# EAGLE design schem (EAGLE 5.10)
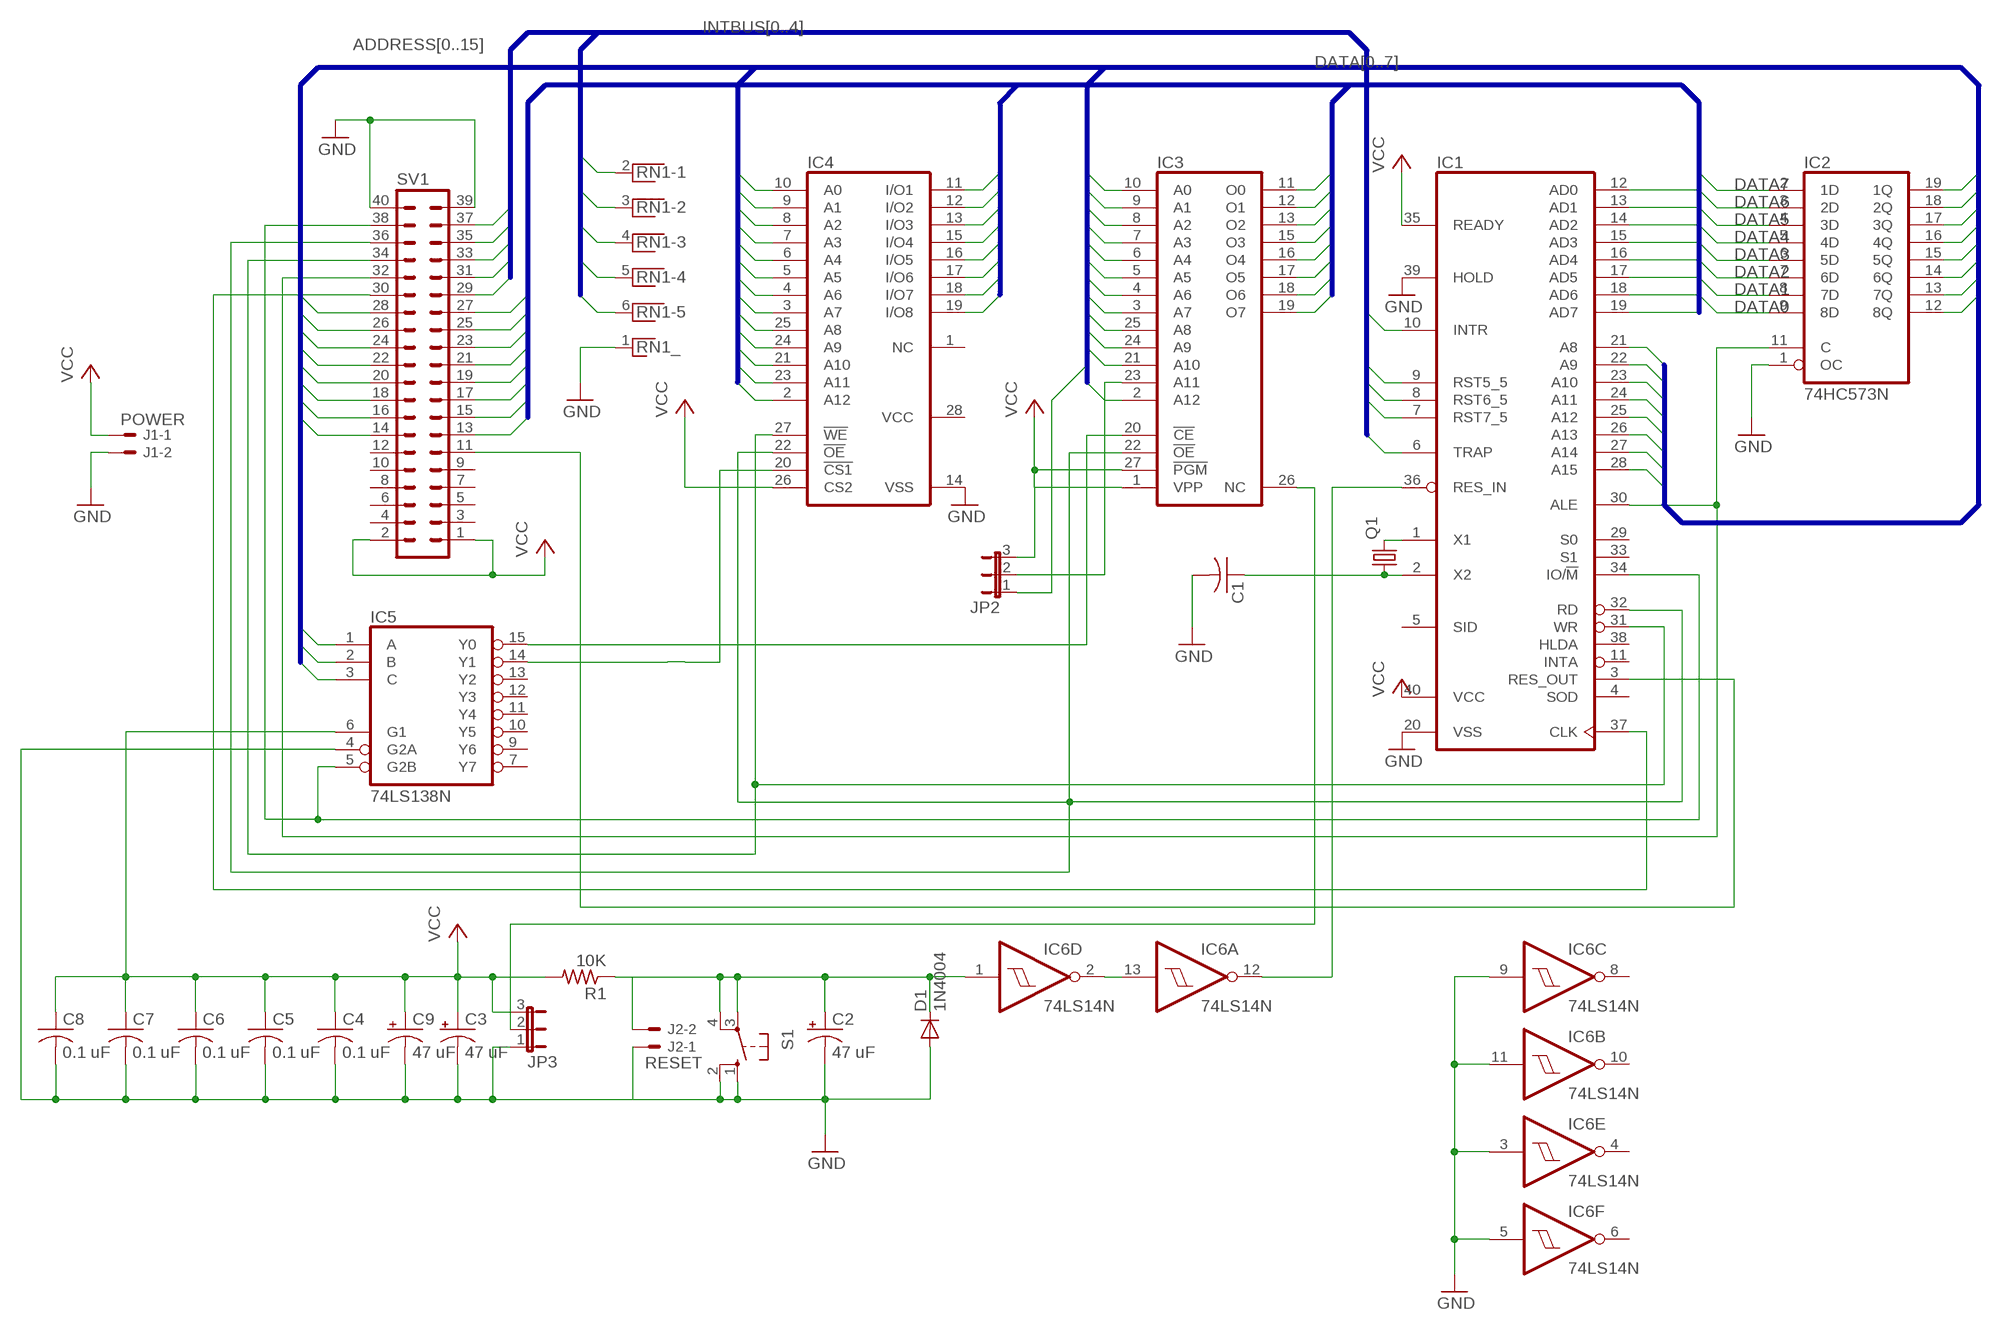
[diagram p0: schematic, sheet 1]

## Parts
C1  C-US050-024X044  [C050-024X044]
C2  47 uF  CPOL-USE2.5-6  [E2,5-6]
C3  47 uF  CPOL-USE15-6AXIAL  [E15-6]
C4  0.1 uF  C-US075-032X103  [C075-032X103]
C5  0.1 uF  C-US075-032X103  [C075-032X103]
C6  0.1 uF  C-US075-032X103  [C075-032X103]
C7  0.1 uF  C-US075-032X103  [C075-032X103]
C8  0.1 uF  C-US075-032X103  [C075-032X103]
C9  47 uF  CPOL-USE15-6AXIAL  [E15-6]
D1  1N4004  [DO41-10]
IC1  8085  [DIL40]
IC2  74HC573N  [DIL20]
IC3  2764  [DIL28]
IC4  6264A  [DIL28-6]
IC5  74LS138N  [DIL16]
IC6  74LS14N  [DIL14]
J1  POWER  22-05-7028-02  [7395-02]
J2  RESET  22-05-7028-02  [7395-02]
JP2  JP2E  [JP2]
JP3  JP2E  [JP2]
Q1  CRYSTALHC18U-H  [HC18U-H]
R1  10K  R-US_0207/10  [0207/10]
RN1  RNX5  [RN-6]
S1  10-XX  [B3F-10XX]
SV1  MA20-2W  [MA20-2W]

## Nets
ADDRESS0: IC2.12(8Q) IC3.10(A0) IC4.10(A0)
ADDRESS1: IC2.13(7Q) IC3.9(A1) IC4.9(A1)
ADDRESS2: IC2.14(6Q) IC3.8(A2) IC4.8(A2)
ADDRESS3: IC2.15(5Q) IC3.7(A3) IC4.7(A3)
ADDRESS4: IC2.16(4Q) IC3.6(A4) IC4.6(A4)
ADDRESS5: IC2.17(3Q) IC3.5(A5) IC4.5(A5)
ADDRESS6: IC2.18(2Q) IC3.4(A6) IC4.4(A6)
ADDRESS7: IC2.19(1Q) IC3.3(A7) IC4.3(A7)
ADDRESS8: IC1.21(A8) IC3.25(A8) IC4.25(A8) SV1.14
ADDRESS9: IC1.22(A9) IC3.24(A9) IC4.24(A9) SV1.16
ADDRESS10: IC1.23(A10) IC3.21(A10) IC4.21(A10) SV1.18
ADDRESS11: IC1.24(A11) IC4.23(A11) JP2.1 SV1.20
ADDRESS12: IC1.25(A12) IC3.2(A12) IC4.2(A12) SV1.22
ADDRESS13: IC1.26(A13) IC5.1(A) SV1.24
ADDRESS14: IC1.27(A14) IC5.2(B) SV1.26
ADDRESS15: IC1.28(A15) IC5.3(C) SV1.28
ALE: IC1.30(ALE) IC2.11(C) SV1.32
CLKOUT: IC1.37(CLK) SV1.30
DATA0: IC1.12(AD0) IC2.9(8D) IC3.11(O0) IC4.11(I/O1) SV1.27
DATA1: IC1.13(AD1) IC2.8(7D) IC3.12(O1) IC4.12(I/O2) SV1.25
DATA2: IC1.14(AD2) IC2.7(6D) IC3.13(O2) IC4.13(I/O3) SV1.23
DATA3: IC1.15(AD3) IC2.6(5D) IC3.15(O3) IC4.15(I/O4) SV1.21
DATA4: IC1.16(AD4) IC2.5(4D) IC3.16(O4) IC4.16(I/O5) SV1.19
DATA5: IC1.17(AD5) IC2.4(3D) IC3.17(O5) IC4.17(I/O6) SV1.17
DATA6: IC1.18(AD6) IC2.3(2D) IC3.18(O6) IC4.18(I/O7) SV1.15
DATA7: IC1.19(AD7) IC2.2(1D) IC3.19(O7) IC4.19(I/O8) SV1.13
GND: C1.2 C2.- C3.- C4.2 C5.2 C6.2 C7.2 C8.2 C9.- D1.A IC1.20(VSS) IC1.39(HOLD) IC2.1(OC) IC4.14(VSS) IC5.4(G2A) IC6.3(E:I) IC6.5(F:I) IC6.9(C:I) IC6.11(B:I) J1.2 J2.1 JP3.1 RN1.1 S1.1(S) S1.2(S1) SV1.39 SV1.40
INTBUS0: IC1.6(TRAP) RN1.2 SV1.37
INTBUS1: IC1.7(RST7_5) RN1.3 SV1.35
INTBUS2: IC1.8(RST6_5) RN1.4 SV1.33
INTBUS3: IC1.9(RST5_5) RN1.5 SV1.31
INTBUS4: IC1.10(INTR) RN1.6 SV1.29
IO/M: IC1.34(IO/!M) IC5.5(G2B) SV1.38
N$1: IC6.2(D:O) IC6.13(A:I)
N$2: IC3.26(NC) JP3.2
N$3: IC4.20(!CS1) IC5.14(Y1)
N$4: IC1.36(RES_IN) IC6.12(A:O)
N$5: IC3.20(!CE) IC5.15(Y0)
N$6: IC1.3(RES_OUT) SV1.11
N$7: IC3.23(A11) JP2.2
N$8: IC1.1(X1) Q1.2
N$10: C1.1 IC1.2(X2) Q1.1
RD: IC1.32(RD) IC3.22(!OE) IC4.22(!OE) SV1.36
RESET_IN: C2.+ D1.C IC6.1(D:I) J2.2 R1.1 S1.3(P) S1.4(P1)
VCC: C3.+ C4.1 C5.1 C6.1 C7.1 C8.1 C9.+ IC1.35(READY) IC1.40(VCC) IC3.1(VPP) IC3.27(!PGM) IC4.26(CS2) IC5.6(G1) J1.1 JP2.3 JP3.3 R1.2 SV1.1 SV1.2
WR: IC1.31(WR) IC4.27(!WE) SV1.34
Unconnected: IC1.4(SOD) IC1.5(SID) IC1.11(INTA) IC1.29(S0) IC1.33(S1) IC1.38(HLDA) IC4.1(NC) IC5.7(Y7) IC5.9(Y6) IC5.10(Y5) IC5.11(Y4) IC5.12(Y3) IC5.13(Y2) IC6.4(E:O) IC6.6(F:O) IC6.8(C:O) IC6.10(B:O) SV1.3 SV1.4 SV1.5 SV1.6 SV1.7 SV1.8 SV1.9 SV1.10 SV1.12

## Buses
DATA[0..7]
ADDRESS[0..15]
INTBUS[0..4]

## Power pins joined to a net without a drawn wire
GND: IC2.10(GND) IC3.14(GND) IC5.8(GND) IC6.7(P:GND)
VCC: IC2.20(VCC) IC3.28(VCC) IC4.28(VCC) IC5.16(VCC) IC6.14(P:VCC)

## Library data of the parts
C1 C4-C8 = resistor:C-US: CAPACITOR, American symbol
C2 C3 C9 = resistor:CPOL-US: POLARIZED CAPACITOR, American symbol
D1 = diode:1N4004: DIODE general purpose rectifier, 1 A
IC1 = micro-intel:8085: MICROCOMPUTER/PERIPHERAL DEVICE
IC2 = 74xx-us:74*573: 8-bit D latch BUS DRIVER
IC3 = memory:2764: MEMORY
IC4 = memory-hitachi:6264A: MEMORY
IC5 = 74xx-us:74*138: 3-line to 8-line DECODER/DEMULTIPLEXER
IC6 = 74xx-us:74*14: Hex schmitt trigger INVERTER
J1 J2 = con-molex:22-?-02: CONNECTOR wire to board 2.54 mm (.1 inch) pitch header
JP2 JP3 = jumper:JP2E: JUMPER
Q1 = crystal:CRYSTAL: CRYSTAL
R1 = resistor:R-US_: RESISTOR, American symbol
RN1 = resistor-net:RNX5: RESISTOR NETWORK
S1 = switch-omron:10-XX: OMRON SWITCH
SV1 = con-lstb:MA20-2W: PIN HEADER

## Board
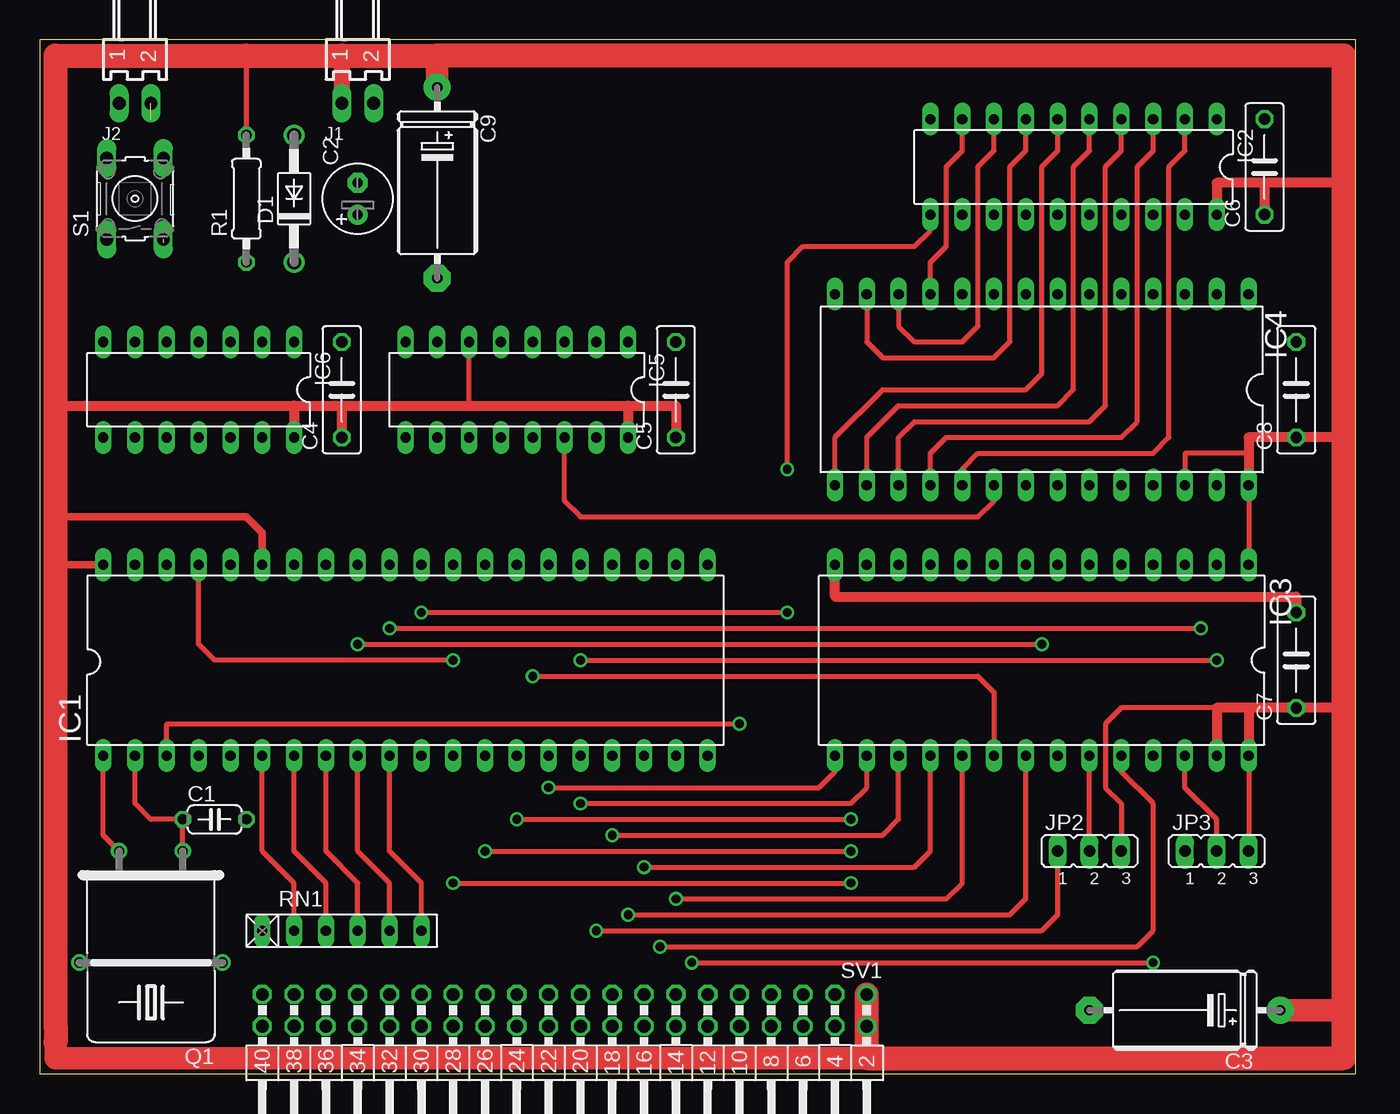
[diagram p1: board, top side]
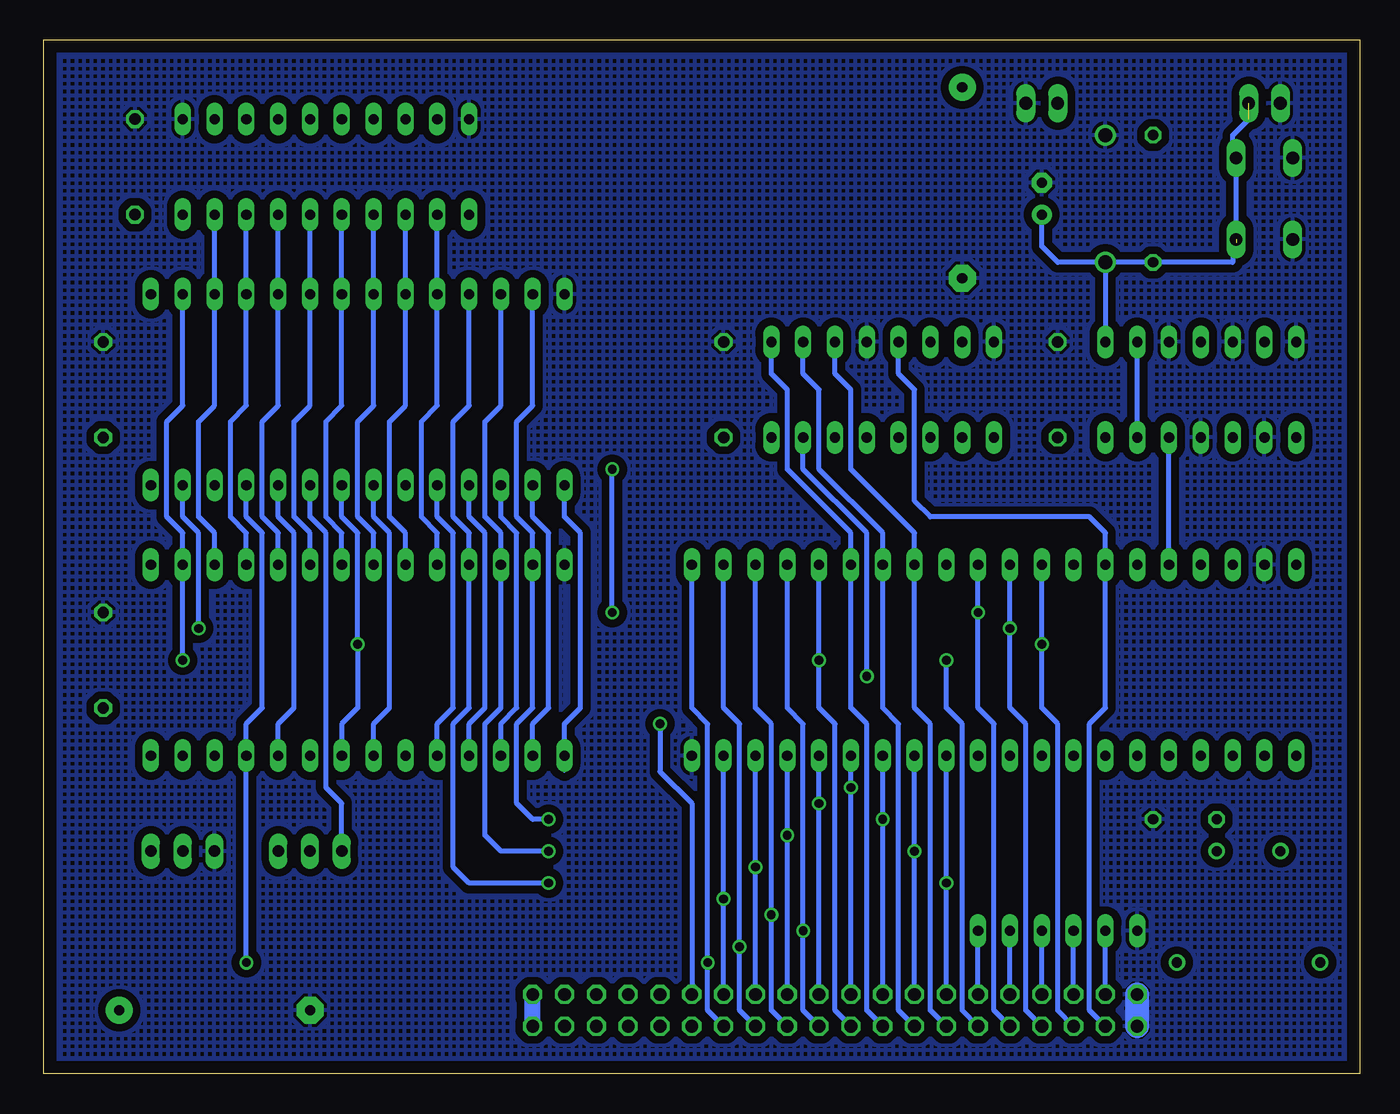
[diagram p2: board, bottom side, seen from below]

Size 105.08 x 82.54 mm. Coordinates in mm from the lower left corner, seen from the top.
Outline: 0,0 105.08,0 105.08,82.54 0,82.54 0,0
Copper layers (1*16): Top 0.035mm / dielectric 1.5mm / Bottom 0.035mm
Design rules "default *": minimum track width 10mil, minimum drill 15mil, track to track 8mil, track to pad 8mil, pad to pad 8mil, via to via 8mil, smd to smd 8mil, copper to edge 40mil, drill to drill 8mil, minimum pad ring 10mil, minimum via ring 8mil, stop-mask expansion 4mil, vias tented up to drill 0mil, thermal gap 10mil

### Footprints (pad centres in the part's own frame; a part is rotated, then mirrored left to right if it is on the bottom)
C050-024X044 = drill 0.813 octagon: 1 -2.54,0; 2 2.54,0
E2,5-6 = drill 0.813 pad 1.6 round: + -1.27,0 | drill 0.813 pad 1.6 octagon: - 1.27,0
E15-6 = drill 0.813 pad 2.159 round: + -7.62,0 | drill 0.813 pad 2.159 octagon: - 7.62,0
C075-032X103 = drill 0.914 octagon: 1 -3.81,0; 2 3.81,0
DO41-10 = drill 1.118 round: A 5.08,0; C -5.08,0
DIL40 = drill 0.813 long: 1 -24.13,-7.62; 2 -21.59,-7.62; 3 -19.05,-7.62; 4 -16.51,-7.62; 5 -13.97,-7.62; 6 -11.43,-7.62; 7 -8.89,-7.62; 8 -6.35,-7.62; 9 -3.81,-7.62; 10 -1.27,-7.62; 11 1.27,-7.62; 12 3.81,-7.62; 13 6.35,-7.62; 14 8.89,-7.62; 15 11.43,-7.62; 16 13.97,-7.62; 17 16.51,-7.62; 18 19.05,-7.62; 19 21.59,-7.62; 20 24.13,-7.62; 21 24.13,7.62; 22 21.59,7.62; 23 19.05,7.62; 24 16.51,7.62; 25 13.97,7.62; 26 11.43,7.62; 27 8.89,7.62; 28 6.35,7.62; 29 3.81,7.62; 30 1.27,7.62; 31 -1.27,7.62; 32 -3.81,7.62; 33 -6.35,7.62; 34 -8.89,7.62; 35 -11.43,7.62; 36 -13.97,7.62; 37 -16.51,7.62; 38 -19.05,7.62; 39 -21.59,7.62; 40 -24.13,7.62
DIL20 = drill 0.813 long: 1 -11.43,-3.81; 2 -8.89,-3.81; 3 -6.35,-3.81; 4 -3.81,-3.81; 5 -1.27,-3.81; 6 1.27,-3.81; 7 3.81,-3.81; 8 6.35,-3.81; 9 8.89,-3.81; 10 11.43,-3.81; 11 11.43,3.81; 12 8.89,3.81; 13 6.35,3.81; 14 3.81,3.81; 15 1.27,3.81; 16 -1.27,3.81; 17 -3.81,3.81; 18 -6.35,3.81; 19 -8.89,3.81; 20 -11.43,3.81
DIL28 = drill 0.813 long: 1 -16.51,-7.62; 2 -13.97,-7.62; 3 -11.43,-7.62; 4 -8.89,-7.62; 5 -6.35,-7.62; 6 -3.81,-7.62; 7 -1.27,-7.62; 8 1.27,-7.62; 9 3.81,-7.62; 10 6.35,-7.62; 11 8.89,-7.62; 12 11.43,-7.62; 13 13.97,-7.62; 14 16.51,-7.62; 15 16.51,7.62; 16 13.97,7.62; 17 11.43,7.62; 18 8.89,7.62; 19 6.35,7.62; 20 3.81,7.62; 21 1.27,7.62; 22 -1.27,7.62; 23 -3.81,7.62; 24 -6.35,7.62; 25 -8.89,7.62; 26 -11.43,7.62; 27 -13.97,7.62; 28 -16.51,7.62
DIL28-6 = drill 0.813 long: 1 -16.51,-7.62; 2 -13.97,-7.62; 3 -11.43,-7.62; 4 -8.89,-7.62; 5 -6.35,-7.62; 6 -3.81,-7.62; 7 -1.27,-7.62; 8 1.27,-7.62; 9 3.81,-7.62; 10 6.35,-7.62; 11 8.89,-7.62; 12 11.43,-7.62; 13 13.97,-7.62; 14 16.51,-7.62; 15 16.51,7.62; 16 13.97,7.62; 17 11.43,7.62; 18 8.89,7.62; 19 6.35,7.62; 20 3.81,7.62; 21 1.27,7.62; 22 -1.27,7.62; 23 -3.81,7.62; 24 -6.35,7.62; 25 -8.89,7.62; 26 -11.43,7.62; 27 -13.97,7.62; 28 -16.51,7.62
DIL16 = drill 0.813 long: 1 -8.89,-3.81; 2 -6.35,-3.81; 3 -3.81,-3.81; 4 -1.27,-3.81; 5 1.27,-3.81; 6 3.81,-3.81; 7 6.35,-3.81; 8 8.89,-3.81; 9 8.89,3.81; 10 6.35,3.81; 11 3.81,3.81; 12 1.27,3.81; 13 -1.27,3.81; 14 -3.81,3.81; 15 -6.35,3.81; 16 -8.89,3.81
DIL14 = drill 0.813 long: 1 -7.62,-3.81; 2 -5.08,-3.81; 3 -2.54,-3.81; 4 0,-3.81; 5 2.54,-3.81; 6 5.08,-3.81; 7 7.62,-3.81; 8 7.62,3.81; 9 5.08,3.81; 10 2.54,3.81; 11 0,3.81; 12 -2.54,3.81; 13 -5.08,3.81; 14 -7.62,3.81
7395-02 = drill 1.016 long: 1 1.27,0; 2 -1.27,0
JP2 = drill 0.914 long: 1 -2.54,0; 2 0,0; 3 2.54,0
HC18U-H = drill 0.813 round: 1 -2.54,-5.08; 2 2.54,-5.08; M -5.715,3.81; M1 5.715,3.81
0207/10 = drill 0.813 octagon: 1 -5.08,0; 2 5.08,0
RN-6 = drill 0.813 long: 1 -6.35,0; 2 -3.81,0; 3 -1.27,0; 4 1.27,0; 5 3.81,0; 6 6.35,0
B3F-10XX = drill 1.016 long: 1 -3.251,2.261; 2 3.251,2.261; 3 -3.251,-2.261; 4 3.251,-2.261
MA20-2W = drill 1.016 octagon: 1 -24.13,-1.27; 2 -24.13,1.27; 3 -21.59,-1.27; 4 -21.59,1.27; 5 -19.05,-1.27; 6 -19.05,1.27; 7 -16.51,-1.27; 8 -16.51,1.27; 9 -13.97,-1.27; 10 -13.97,1.27; 11 -11.43,-1.27; 12 -11.43,1.27; 13 -8.89,-1.27; 14 -8.89,1.27; 15 -6.35,-1.27; 16 -6.35,1.27; 17 -3.81,-1.27; 18 -3.81,1.27; 19 -1.27,-1.27; 20 -1.27,1.27; 21 1.27,-1.27; 22 1.27,1.27; 23 3.81,-1.27; 24 3.81,1.27; 25 6.35,-1.27; 26 6.35,1.27; 27 8.89,-1.27; 28 8.89,1.27; 29 11.43,-1.27; 30 11.43,1.27; 31 13.97,-1.27; 32 13.97,1.27; 33 16.51,-1.27; 34 16.51,1.27; 35 19.05,-1.27; 36 19.05,1.27; 37 21.59,-1.27; 38 21.59,1.27; 39 24.13,-1.27; 40 24.13,1.27

### Placement (x,y rotation side)
C1  13.97,20.32 0 top
C2  25.4,69.85 90 top
C3  91.44,5.08 180 top
C4  24.13,54.61 90 top
C5  50.8,54.61 90 top
C6  97.79,72.39 90 top
C7  100.33,33.02 90 top
C8  100.33,54.61 90 top
C9  31.75,71.12 270 top
D1  20.32,69.85 90 top
IC1  29.21,33.02 0 top
IC2  82.55,72.39 180 top
IC3  80.01,33.02 180 top
IC4  80.01,54.61 180 top
IC5  38.1,54.61 180 top
IC6  12.7,54.61 180 top
J1  25.4,77.47 180 top
J2  7.62,77.47 180 top
JP2  83.82,17.78 0 top
JP3  93.98,17.78 0 top
Q1  8.89,12.7 180 top
R1  16.51,69.85 90 top
RN1  24.13,11.43 0 top
S1  7.62,69.85 90 top
SV1  41.91,5.08 180 top

### Tracks (layer width: path | path; a pad name or v marks a point on that pad's centre or on a via)
ADDRESS0
  Bottom 0.406: IC3.10 73.66,43.18 74.93,44.45 74.93,52.07 73.66,53.34 IC4.10 IC2.12
ADDRESS1
  Bottom 0.406: IC3.9 76.2,43.18 77.47,44.45 77.47,52.07 76.2,53.34 IC4.9 IC2.13
ADDRESS2
  Bottom 0.406: IC3.8 78.74,43.18 80.01,44.45 80.01,52.07 78.74,53.34 IC4.8 IC2.14
ADDRESS3
  Bottom 0.406: IC3.7 81.28,43.18 82.55,44.45 82.55,52.07 81.28,53.34 IC4.7 IC2.15
ADDRESS4
  Bottom 0.406: IC3.6 83.82,43.18 85.09,44.45 85.09,52.07 83.82,53.34 IC4.6 IC2.16
ADDRESS5
  Bottom 0.406: IC3.5 86.36,43.18 87.63,44.45 87.63,52.07 86.36,53.34 IC4.5 IC2.17
ADDRESS6
  Bottom 0.406: IC3.4 88.9,43.18 90.17,44.45 90.17,52.07 88.9,53.34 IC4.4 IC2.18
ADDRESS7
  Bottom 0.406: IC3.3 91.44,43.18 92.71,44.45 92.71,52.07 91.44,53.34 IC4.3 IC2.19
ADDRESS8  (via drill 0.7)
  Top 0.406: v52.07,8.89 v88.9,8.89
  Bottom 0.406: IC4.25 88.9,44.45 87.63,43.18 87.63,29.21 88.9,27.94 IC3.25 v88.9,8.89 | IC1.21 53.34,29.21 52.07,27.94 v52.07,8.89 52.07,5.08 SV1.14
ADDRESS9  (via drill 0.7)
  Top 0.406: IC3.24 86.36,24.13 88.9,21.59 88.9,11.43 87.63,10.16 v49.53,10.16
  Bottom 0.406: IC4.24 86.36,44.45 85.09,43.18 85.09,29.21 86.36,27.94 IC3.24 | IC1.22 50.8,29.21 49.53,27.94 v49.53,10.16 49.53,5.08 SV1.16
ADDRESS10  (via drill 0.7)
  Top 0.406: IC3.21 78.74,13.97 77.47,12.7 v46.99,12.7
  Bottom 0.406: IC4.21 78.74,44.45 77.47,43.18 77.47,29.21 78.74,27.94 IC3.21 | IC1.23 48.26,29.21 46.99,27.94 v46.99,12.7 46.99,5.08 SV1.18
ADDRESS11  (via drill 0.7)
  Top 0.406: v44.45,11.43 80.01,11.43 81.28,12.7 JP2.1
  Bottom 0.406: IC1.24 45.72,29.21 44.45,27.94 v44.45,11.43 44.45,5.08 SV1.20 | JP2.1 81.28,21.59 82.55,22.86 82.55,43.18 83.82,44.45 IC4.23
ADDRESS12  (via drill 0.7)
  Top 0.406: v43.18,33.02 v93.98,33.02
  Bottom 0.406: IC4.2 93.98,53.34 95.25,52.07 95.25,44.45 93.98,43.18 IC3.2 v93.98,33.02 | IC1.25 v43.18,33.02 43.18,29.21 41.91,27.94 41.91,5.08 SV1.22
ADDRESS13
  Bottom 0.406: SV1.24 39.37,5.08 39.37,27.94 40.64,29.21 IC1.26 40.64,43.18 45.72,48.26 45.72,54.61 46.99,55.88 IC5.1
ADDRESS14
  Bottom 0.406: SV1.26 36.83,5.08 36.83,27.94 38.1,29.21 IC1.27 38.1,43.18 43.18,48.26 43.18,54.61 44.45,55.88 IC5.2
ADDRESS15
  Bottom 0.406: SV1.28 34.29,5.08 34.29,27.94 35.56,29.21 IC1.28 35.56,43.18 40.64,48.26 40.64,54.61 41.91,55.88 IC5.3
ALE  (via drill 0.7)
  Top 0.406: v30.48,36.83 v59.69,36.83 | IC2.11 71.12,67.31 69.85,66.04 60.96,66.04 59.69,64.77 v59.69,48.26
  Bottom 0.406: IC1.30 v30.48,36.83 30.48,29.21 29.21,27.94 29.21,5.08 SV1.32 | v59.69,36.83 v59.69,48.26
CLKOUT  (via drill 0.7)
  Top 0.406: v33.02,33.02 13.97,33.02 12.7,34.29 IC1.37
  Bottom 0.406: SV1.30 31.75,5.08 31.75,27.94 33.02,29.21 v33.02,33.02
DATA0  (via drill 0.7)
  Top 0.406: IC2.9 73.66,73.66 72.39,72.39 72.39,66.04 71.12,64.77 IC4.11 | v33.02,15.24 v64.77,15.24
  Bottom 0.406: IC4.11 71.12,53.34 72.39,52.07 72.39,44.45 71.12,43.18 IC3.11 71.12,29.21 72.39,27.94 72.39,16.51 71.12,15.24 v64.77,15.24 | SV1.27 v33.02,15.24 IC1.12
DATA1  (via drill 0.7)
  Top 0.406: IC2.8 76.2,73.66 74.93,72.39 74.93,59.69 73.66,58.42 69.85,58.42 68.58,59.69 IC4.12 | v35.56,17.78 v64.77,17.78
  Bottom 0.406: IC4.12 68.58,53.34 69.85,52.07 69.85,44.45 68.58,43.18 IC3.12 68.58,29.21 69.85,27.94 69.85,19.05 68.58,17.78 v64.77,17.78 | SV1.25 v35.56,17.78 IC1.13
DATA2  (via drill 0.7)
  Top 0.406: IC2.7 78.74,73.66 77.47,72.39 77.47,58.42 76.2,57.15 67.31,57.15 66.04,58.42 IC4.13 | v38.1,20.32 v64.77,20.32
  Bottom 0.406: IC4.13 66.04,53.34 67.31,52.07 67.31,44.45 66.04,43.18 IC3.13 66.04,29.21 67.31,27.94 67.31,21.59 66.04,20.32 v64.77,20.32 | SV1.23 v38.1,20.32 IC1.14
DATA3  (via drill 0.7)
  Top 0.406: IC2.6 81.28,73.66 80.01,72.39 80.01,55.88 78.74,54.61 67.31,54.61 63.5,50.8 IC4.15 | v40.64,22.86 62.23,22.86 63.5,24.13 IC3.15
  Bottom 0.254: IC3.15 63.5,24.13
  Bottom 0.406: SV1.21 v40.64,22.86 IC1.15 | IC3.15 63.5,27.94 62.23,29.21 62.23,43.18 63.5,44.45 IC4.15
DATA4  (via drill 0.7)
  Top 0.406: IC2.5 83.82,73.66 82.55,72.39 82.55,54.61 81.28,53.34 68.58,53.34 66.04,50.8 IC4.16 | v43.18,21.59 64.77,21.59 66.04,22.86 IC3.16
  Bottom 0.406: IC4.16 66.04,44.45 64.77,43.18 64.77,29.21 66.04,27.94 IC3.16 | SV1.19 v43.18,21.59 IC1.16
DATA5  (via drill 0.7)
  Top 0.406: IC2.4 86.36,73.66 85.09,72.39 85.09,53.34 83.82,52.07 69.85,52.07 68.58,50.8 IC4.17 | IC3.17 68.58,20.32 67.31,19.05 v45.72,19.05
  Bottom 0.406: IC4.17 68.58,44.45 67.31,43.18 67.31,29.21 68.58,27.94 IC3.17 | SV1.17 v45.72,19.05 IC1.17
DATA6  (via drill 0.7)
  Top 0.406: IC2.3 88.9,73.66 87.63,72.39 87.63,52.07 86.36,50.8 72.39,50.8 71.12,49.53 IC4.18 | IC3.18 71.12,17.78 69.85,16.51 v48.26,16.51
  Bottom 0.406: IC4.18 71.12,44.45 69.85,43.18 69.85,29.21 71.12,27.94 IC3.18 | SV1.15 v48.26,16.51 IC1.18
DATA7  (via drill 0.7)
  Top 0.406: IC4.19 73.66,48.26 74.93,49.53 88.9,49.53 90.17,50.8 90.17,72.39 91.44,73.66 IC2.2 | IC3.19 73.66,15.24 72.39,13.97 v50.8,13.97
  Bottom 0.406: IC4.19 73.66,44.45 72.39,43.18 72.39,29.21 73.66,27.94 IC3.19 | SV1.13 v50.8,13.97 IC1.19
GND
  Top 0.813: IC3.14 63.5,38.1 100.33,38.1 C7.2
  Bottom 1.93: SV1.40 SV1.39
  pour Bottom (isolate 0.61, hatched): 0,82.55 105.41,82.55 105.41,0 0,0
INTBUS0
  Top 0.406: IC1.6 17.78,17.78 20.32,15.24 RN1.2
  Bottom 0.406: SV1.37 RN1.2
INTBUS1
  Top 0.406: IC1.7 20.32,17.78 22.86,15.24 RN1.3
  Bottom 0.406: SV1.35 RN1.3
INTBUS2
  Top 0.406: IC1.8 22.86,17.78 25.4,15.24 RN1.4
  Bottom 0.406: SV1.33 RN1.4
INTBUS3
  Top 0.406: IC1.9 25.4,17.78 27.94,15.24 RN1.5
  Bottom 0.406: SV1.31 RN1.5
INTBUS4
  Top 0.406: IC1.10 27.94,17.78 30.48,15.24 RN1.6
  Bottom 0.406: SV1.29 RN1.6
IO/M
  Bottom 0.406: SV1.38 21.59,5.08 21.59,27.94 20.32,29.21 IC1.34 20.32,43.18 21.59,44.45 34.29,44.45 35.56,45.72 35.56,54.61 36.83,55.88 IC5.5
N$1
  Bottom 0.406: IC6.13 IC6.2
N$2
  Top 0.406: JP3.2 93.98,20.32 91.44,22.86 IC3.26
N$3
  Top 0.406: IC5.14 41.91,45.72 43.18,44.45 74.93,44.45 76.2,45.72 IC4.20
N$4
  Bottom 0.406: IC1.36 IC6.12
N$5  (via drill 0.7)
  Top 0.406: v39.37,31.75 74.93,31.75 76.2,30.48 IC3.20
  Bottom 0.406: IC5.15 44.45,48.26 39.37,43.18 v39.37,31.75
N$6  (via drill 0.7)
  Top 0.406: v55.88,27.94 10.16,27.94 IC1.3
  Bottom 0.406: SV1.11 53.34,21.59 55.88,24.13 v55.88,27.94
N$7
  Top 0.406: JP2.2 IC3.23
N$8
  Top 0.406: Q1.2 5.08,19.05 IC1.1
N$10
  Top 0.406: Q1.1 C1.1 8.89,20.32 7.62,21.59 IC1.2
RD  (via drill 0.7)
  Top 0.406: v25.4,34.29 v80.01,34.29
  Bottom 0.406: IC4.22 81.28,44.45 80.01,43.18 v80.01,34.29 80.01,29.21 81.28,27.94 IC3.22 | IC1.32 v25.4,34.29 25.4,29.21 24.13,27.94 24.13,5.08 SV1.36
RESET_IN  (2 unrouted)
  Bottom 0.406: D1.C R1.1 10.16,64.77 10.16,67.03 9.88,67.31 | 9.88,67.31 9.88,66.32 10.16,66.04 | 9.88,67.31 S1.4 10.16,73.38 10.16,74.93 8.89,76.2 | D1.C IC6.1 | C2.+ 25.4,66.04 24.13,64.77 D1.C
VCC
  Top 0.406: JP2.3 86.36,21.59 85.09,22.86 85.09,27.94 86.36,29.21 93.98,29.21 | IC3.28 JP3.3 | IC4.28 IC3.1 | IC4.26 91.44,49.53 96.52,49.53 | 16.51,81.28 R1.2 | 34.29,53.34 IC5.6
  Top 0.61: 1.27,40.64 IC1.40 | IC1.35 17.78,43.18 16.51,44.45 1.27,44.45
  Top 0.813: IC2.20 93.98,71.12 97.79,71.12 | 104.14,71.12 97.79,71.12 | 97.79,71.12 C6.1 | IC4.28 96.52,49.53 96.52,50.8 C8.1 104.14,50.8 | 96.52,29.21 IC3.28 | IC3.27 93.98,29.21 96.52,29.21 | 96.52,29.21 C7.1 104.14,29.21 | 20.32,53.34 IC6.14 | 1.27,53.34 20.32,53.34 | 24.13,53.34 C4.1 | 20.32,53.34 24.13,53.34 | 24.13,53.34 34.29,53.34 46.99,53.34 | 46.99,53.34 IC5.16 | C5.1 50.8,53.34 46.99,53.34
  Top 1.27: 24.13,81.28 J1.1
  Top 1.778: 66.04,1.27 1.27,1.27 1.27,3.81 | 104.14,5.08 C3.+ | 31.75,81.28 C9.+
  Top 1.93: 1.27,2.54 1.27,3.81 1.27,40.64 1.27,44.45 1.27,53.34 1.27,81.28 16.51,81.28 24.13,81.28 31.75,81.28 104.14,81.28 104.14,71.12 104.14,50.8 104.14,29.21 104.14,5.08 104.14,1.27 66.04,1.27 SV1.2 SV1.1
  Bottom 1.27: SV1.2 SV1.1
WR  (via drill 0.7)
  Top 0.406: v27.94,35.56 v92.71,35.56
  Bottom 0.406: IC4.27 93.98,44.45 92.71,43.18 v92.71,35.56 | IC1.31 v27.94,35.56 27.94,29.21 26.67,27.94 26.67,5.08 SV1.34